# EAGLE schematic gps_and_sensor_CURRENT (EAGLE 8.7.1)
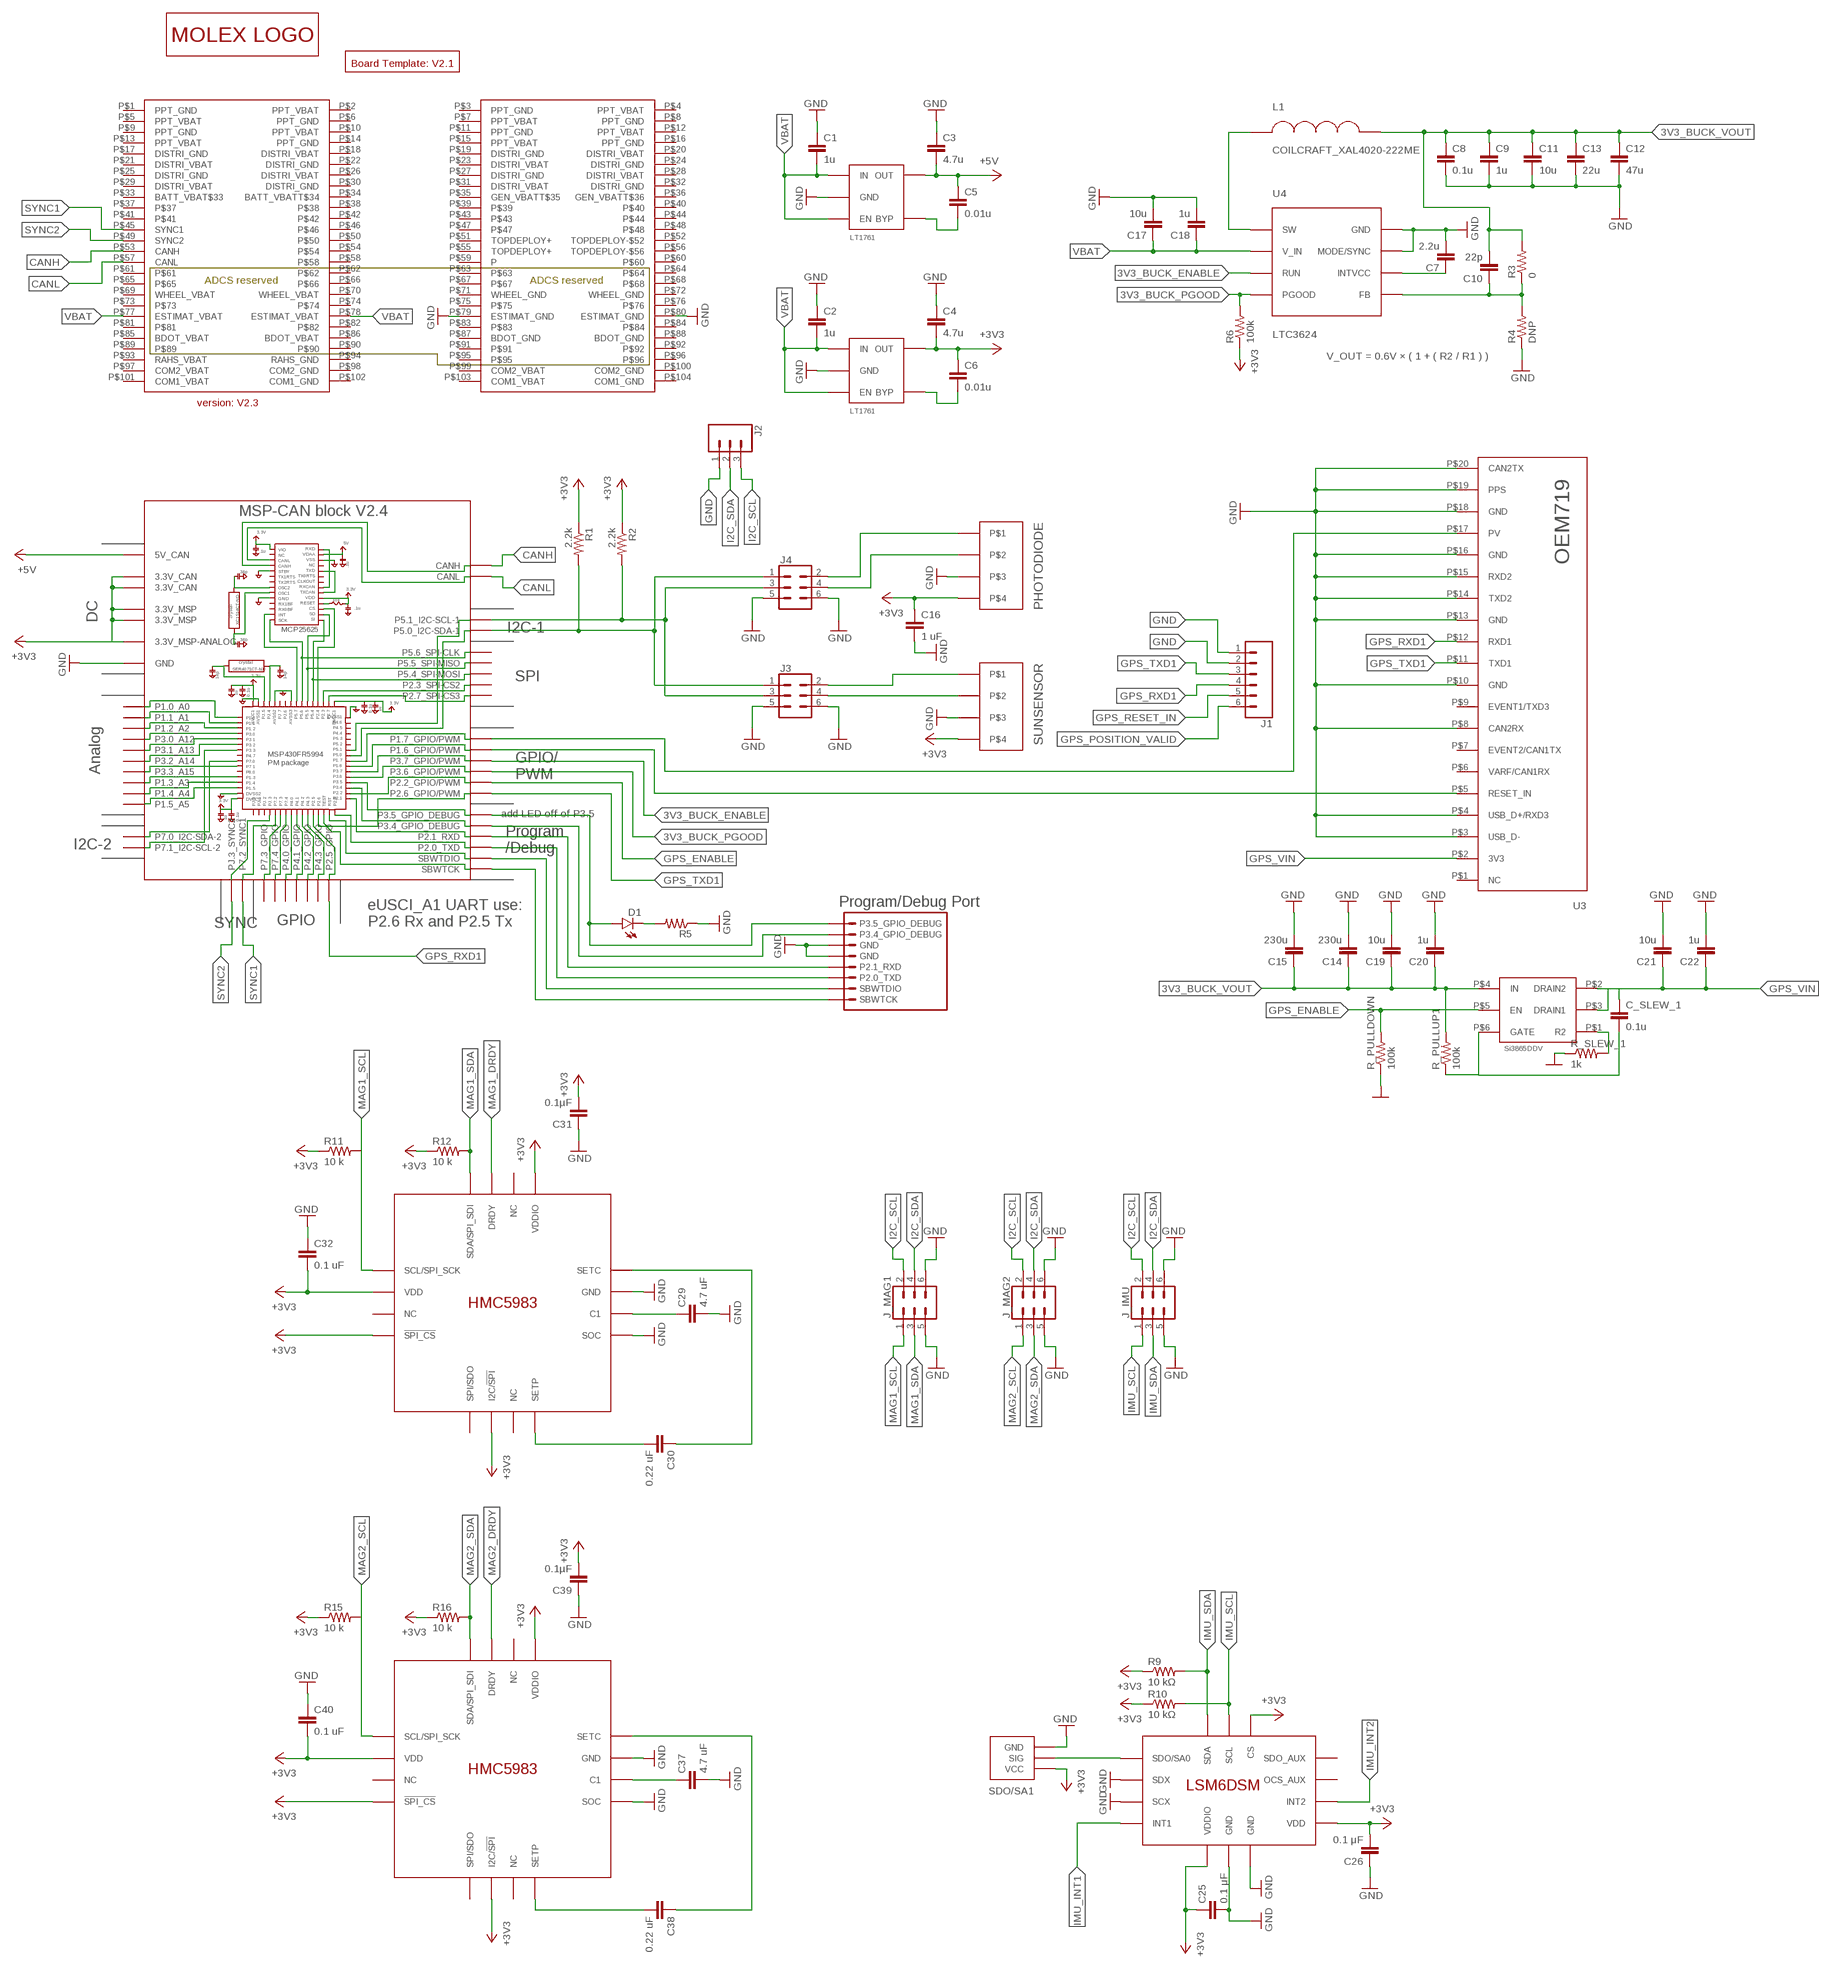
[diagram p0: schematic, sheet 1]

## Parts
B1  BOARD_TEMPLATESERCURED  [BOARD_TEMPLATE_SECURED]
BLK1  MSP-CAN_BLOCK  [MSP-CAN_BLOCK]
C1  1u  CAPACITOR0805  [0805]
C2  1u  CAPACITOR0805  [0805]
C3  4.7u  CAPACITOR0805  [0805]
C4  4.7u  CAPACITOR0805  [0805]
C5  0.01u  CAPACITOR0805  [0805]
C6  0.01u  CAPACITOR0805  [0805]
C7  2.2u  CAPACITOR0805  [0805]
C8  0.1u  CAPACITOR0805  [0805]
C9  1u  CAPACITOR0805  [0805]
C10  22p  CAPACITOR0805  [0805]
C11  10u  CAPACITOR0805  [0805]
C12  47u  CAPACITOR1206  [1206]
C13  22u  CAPACITOR1206  [1206]
C14  230u  CAPACITORPANASONIC_16SVPG270M  [PANASONIC_SVPG]
C15  230u  CAPACITORPANASONIC_16SVPG270M  [PANASONIC_SVPG]
C16  1 uF  CAPACITOR0805  [0805]
C17  10u  CAPACITOR0805  [0805]
C18  1u  CAPACITOR0805  [0805]
C19  10u  CAPACITOR0805  [0805]
C20  1u  CAPACITOR0805  [0805]
C21  10u  CAPACITOR0805  [0805]
C22  1u  CAPACITOR0805  [0805]
C25  0.1 μF  CAPACITOR0805  [0805]
C26  0.1 μF  CAPACITOR0805  [0805]
C29  4.7 uF  CAPACITOR0805  [0805]
C30  0.22 uF  CAPACITOR0805  [0805]
C31  0.1µF  CAPACITOR0805  [0805]
C32  0.1 uF  CAPACITOR0805  [0805]
C37  4.7 uF  CAPACITOR0805  [0805]
C38  0.22 uF  CAPACITOR0805  [0805]
C39  0.1µF  CAPACITOR0805  [0805]
C40  0.1 uF  CAPACITOR0805  [0805]
C_SLEW_1  0.1u  CAPACITOR0805  [0805]
CONN1  PC104_CONNECTOR  [PC104_CONNECTOR]
D1  LED  [LED-1206]
J1  CONN_06LOCK  [1X06_LOCK]
J2  CONN_03LOCK  [1X03_LOCK]
J3  CONN_03X22X3_SILK_MALE_PTH  [2X3]
J4  CONN_03X22X3_SILK_MALE_PTH  [2X3]
J_IMU  CONN_03X22X3_SILK_MALE_PTH  [2X3]
J_MAG1  CONN_03X22X3_SILK_MALE_PTH  [2X3]
J_MAG2  CONN_03X22X3_SILK_MALE_PTH  [2X3]
L1  COILCRAFT_XAL4020-222ME  [COILCRAFT_XAL4020]
PHOTODIODE  PICOLOCK_4  [PICOLOCK_4]
R1  2.2k  RESISTOR0805  [0805]
R2  2.2k  RESISTOR0805  [0805]
R3  0  RESISTOR0805  [0805]
R4  DNP  RESISTOR0805  [0805]
R5  RESISTOR0805  [0805]
R6  100k  RESISTOR0805  [0805]
R9  10 kΩ  RESISTOR0805  [0805]
R10  10 kΩ  RESISTOR0805  [0805]
R11  10 k  RESISTOR0805  [0805]
R12  10 k  RESISTOR0805  [0805]
R15  10 k  RESISTOR0805  [0805]
R16  10 k  RESISTOR0805  [0805]
R_PULLDOWN  100k  RESISTOR0805  [0805]
R_PULLUP1  100k  RESISTOR0805  [0805]
R_SLEW_1  1k  RESISTOR0805  [0805]
SDO/SA1  0_OHM_JUMPER  [0_OHM_JUMPER]
SUNSENSOR  PICOLOCK_4  [PICOLOCK_4]
U1  LT1761-X  [SOT-23-5]
U2  LT1761-X  [SOT-23-5]
U3  OEM719  [OEM719]
U4  LTC3624  [LTC3624]
U$1  LOGO_MOLEX  [LOGO_MOLEX]
U$2  PROGRAM/DEBUG_PORT  [1X08_CONNECTOR]
U$3  SI3865DDV  [TSOP-6]
U$5  LSM6DSM  [LSM6DSM]
U$6  HMC5983  [HMC5983]
U$8  HMC5983  [HMC5983]

## Nets
3V3_BUCK_ENABLE: BLK1.P3.7_GPIO/PWM U4.RUN
3V3_BUCK_FB: C10.1 R3.1 R4.2 U4.FB
3V3_BUCK_INTVCC: C7.1 U4.INTVCC
3V3_BUCK_PGOOD: BLK1.P3.6_GPIO/PWM R6.2 U4.PGOOD
3V3_BUCK_SW: L1.P$1 U4.SW
3V3_BUCK_VOUT: C8.1 C9.1 C10.2 C11.1 C12.1 C13.1 C14.POS C15.POS C19.1 C20.1 L1.P$2 R3.2 R_PULLUP1.2 U$3.P$4(IN)
+3V3: R6.1
CANH: BLK1.CANH CONN1.P$53(CANH)
CANL: BLK1.CANL CONN1.P$57(CANL)
GND: BLK1.GND@1(GND) BLK1.GND@2(GND) BLK1.GND@3(GND) BLK1.GND@4(GND) BLK1.GND@5(GND) BLK1.GND@7(GND) BLK1.GND@8(GND) BLK1.GND@9(GND) BLK1.GND@10(GND) BLK1.GND@11(GND) BLK1.GND@12(GND) BLK1.GND@13(GND) BLK1.GND@14(GND) BLK1.GND@15(GND) BLK1.GND@16(GND) BLK1.GND@17(GND) BLK1.GND@26(GND) C1.1 C2.1 C3.1 C4.1 C7.2 C8.2 C9.2 C11.2 C12.2 C13.2 C14.NEG C15.NEG C16.2 C17.2 C18.2 C19.2 C20.2 C21.2 C22.2 C25.2 C26.1 C29.2 C31.1 C32.1 C37.2 C39.1 C40.1 CONN1.P$79(ESTIMAT_GND) CONN1.P$80(ESTIMAT_GND) J1.1 J1.2 J2.1 J3.5 J3.6 J4.5 J4.6 J_IMU.5 J_IMU.6 J_MAG1.5 J_MAG1.6 J_MAG2.5 J_MAG2.6 PHOTODIODE.P$3 R4.1 R5.1 R_PULLDOWN.1 R_SLEW_1.1 SDO/SA1.P$1(GND) SUNSENSOR.P$3 U1.P$2(GND) U2.P$2(GND) U3.P$3(USB_D-) U3.P$4(USB_D+/RXD3) U3.P$8(CAN2RX) U3.P$10(GND) U3.P$13(GND) U3.P$14(TXD2) U3.P$15(RXD2) U3.P$16(GND) U3.P$18(GND) U3.P$19(PPS) U3.P$20(CAN2TX) U4.GND@1(GND) U4.GND@PAD(GND) U4.MODE/SYNC U$2.5(GND) U$2.6(GND) U$5.GND@1(GND) U$5.GND@2(GND) U$5.SCX U$5.SDX U$6.GND U$6.SOC U$8.GND U$8.SOC ; supply symbol labelled DGND
GPS_ENABLE: BLK1.P2.2_GPIO/PWM R_PULLDOWN.2 U$3.P$5(EN)
GPS_POSITION_VALID: BLK1.P1.7_GPIO/PWM J1.6 U3.P$17(PV)
GPS_RESET_IN: BLK1.P1.6_GPIO/PWM J1.5 U3.P$5(RESET_IN)
GPS_RXD1: BLK1.P2.5_GPIO J1.4 U3.P$12(RXD1)
GPS_TXD1: BLK1.P2.6_GPIO/PWM J1.3 U3.P$11(TXD1)
GPS_VIN: C21.1 C22.1 C_SLEW_1.1 U3.P$2(3V3) U$3.P$2(DRAIN2) U$3.P$3(DRAIN1)
I2C_SCL: BLK1.P5.1_I2C-SCL-1 J2.3 J3.3 J4.3 J_IMU.2 J_MAG1.2 J_MAG2.2 R2.2
I2C_SDA: BLK1.P5.0_I2C-SDA-1 J2.2 J3.1 J4.1 J_IMU.4 J_MAG1.4 J_MAG2.4 R1.2
IMU_INT1: U$5.INT1
IMU_INT2: U$5.INT2
IMU_SCL: J_IMU.1 R10.2 U$5.SCL
IMU_SDA: J_IMU.3 R9.2 U$5.SDA
LDO_3V3: BLK1.3.3V@CAN1(3.3V_CAN) BLK1.3.3V@CAN2(3.3V_CAN) BLK1.3.3V@MSP1(3.3V_MSP) BLK1.3.3V@MSP2(3.3V_MSP) BLK1.3.3V_ANALOG@MSP2(3.3V_MSP-ANALOG) C4.2 C6.1 C16.1 C25.1 C26.2 C31.2 C32.2 C39.2 C40.2 PHOTODIODE.P$4 R1.1 R2.1 R9.1 R10.1 R11.1 R12.1 R15.1 R16.1 SDO/SA1.P$3(VCC) SUNSENSOR.P$4 U2.P$5(OUT) U$5.CS U$5.VDD U$5.VDDIO U$6.!SPI_CS U$6.I2C/!SPI U$6.VDD U$6.VDDIO U$8.!SPI_CS U$8.I2C/!SPI U$8.VDD U$8.VDDIO ; supply symbol labelled +3V3
LDO_3V3_BYP: C6.2 U2.P$4(BYP)
LDO_5V: BLK1.5V(5V_CAN) C3.2 C5.1 U1.P$5(OUT) ; supply symbol labelled +5V
LDO_5V_BYP: C5.2 U1.P$4(BYP)
MA1G_C2: C29.1 U$6.C1
MAG1_DRDY: U$6.DRDY
MAG1_SCL: J_MAG1.1 R11.2 U$6.SCL/SPI_SCK
MAG1_SDA: J_MAG1.3 R12.2 U$6.SDA/SPI_SDI
MAG1_SETC1: C30.1 U$6.SETC
MAG1_SETP1: C30.2 U$6.SETP
MAG2_C1: C37.1 U$8.C1
MAG2_DRDY: U$8.DRDY
MAG2_SCL: J_MAG2.1 R15.2 U$8.SCL/SPI_SCK
MAG2_SDA: J_MAG2.3 R16.2 U$8.SDA/SPI_SDI
MAG2_SETC: C38.1 U$8.SETC
MAG2_SETP: C38.2 U$8.SETP
N$1: BLK1.P3.5_GPIO_DEBUG D1.A U$2.8(P3.5_GPIO_DEBUG)
N$2: R_SLEW_1.2 U$3.P$1(R2)
N$3: BLK1.P3.4_GPIO_DEBUG U$2.7(P3.4_GPIO_DEBUG)
N$4: C_SLEW_1.2 R_PULLUP1.1 U$3.P$6(GATE)
N$5: BLK1.P2.1_RXD U$2.4(P2.1_RXD)
N$6: BLK1.P2.0_TXD U$2.3(P2.0_TXD)
N$7: BLK1.SBWTDIO U$2.2(SBWTDIO)
N$8: BLK1.SBWTCK U$2.SBWTCK
N$9: D1.C R5.2
N$11: SDO/SA1.P$2(SIG) U$5.SDO/SA0
PHOTODIODE_SCL: J4.4 PHOTODIODE.P$2
PHOTODIODE_SDA: J4.2 PHOTODIODE.P$1
SUNSENSOR_SCL: J3.4 SUNSENSOR.P$2
SUNSENSOR_SDA: J3.2 SUNSENSOR.P$1
SYNC1: BLK1.P7.2_SYNC1 CONN1.P$45(SYNC1)
SYNC2: BLK1.PJ.3_SYNC2 CONN1.P$49(SYNC2)
VBAT: C1.2 C2.2 C17.1 C18.1 CONN1.P$77(ESTIMAT_VBAT) CONN1.P$78(ESTIMAT_VBAT) U1.P$1(IN) U1.P$3(EN) U2.P$1(IN) U2.P$3(EN) U4.V_IN
Unconnected: BLK1.P1.0_A0 BLK1.P1.1_A1 BLK1.P1.2_A2 BLK1.P1.3_A3 BLK1.P1.4_A4 BLK1.P1.5_A5 BLK1.P2.4_SPI-CS2(P2.3_SPI-CS2) BLK1.P2.7_SPI-CS3 BLK1.P3.0_A12 BLK1.P3.1_A13 BLK1.P3.2_A14 BLK1.P3.3_A15 BLK1.P4.0_GPIO BLK1.P4.1_GPIO BLK1.P4.2_GPIO BLK1.P4.3_GPIO BLK1.P5.4_SPI-MOSI BLK1.P5.5_SPI-MISO BLK1.P5.6_SPI-CLK BLK1.P7.0_I2C-SDA-2 BLK1.P7.1_I2C-SCL-2 BLK1.P7.3_GPIO BLK1.P7.4_GPIO CONN1.P$1(PPT_GND) CONN1.P$2(PPT_VBAT) CONN1.P$3(PPT_GND) CONN1.P$4(PPT_VBAT) CONN1.P$5(PPT_VBAT) CONN1.P$6(PPT_GND) CONN1.P$7(PPT_VBAT) CONN1.P$8(PPT_GND) CONN1.P$9(PPT_GND) CONN1.P$10(PPT_VBAT) CONN1.P$11(PPT_GND) CONN1.P$12(PPT_VBAT) CONN1.P$13(PPT_VBAT) CONN1.P$14(PPT_GND) CONN1.P$15(PPT_VBAT) CONN1.P$16(PPT_GND) CONN1.P$17(DISTRI_GND) CONN1.P$18(DISTRI_VBAT) CONN1.P$19(DISTRI_GND) CONN1.P$20(DISTRI_VBAT) CONN1.P$21(DISTRI_VBAT) CONN1.P$22(DISTRI_GND) CONN1.P$23(DISTRI_VBAT) CONN1.P$24(DISTRI_GND) CONN1.P$25(DISTRI_GND) CONN1.P$26(DISTRI_VBAT) CONN1.P$27(DISTRI_GND) CONN1.P$28(DISTRI_VBAT) CONN1.P$29(DISTRI_VBAT) CONN1.P$30(DISTRI_GND) CONN1.P$31(DISTRI_VBAT) CONN1.P$32(DISTRI_GND) CONN1.P$33(BATT_VBAT$33) CONN1.P$34(BATT_VBATT$34) CONN1.P$35(GEN_VBATT$35) CONN1.P$36(GEN_VBATT$36) CONN1.P$37 CONN1.P$38 CONN1.P$39 CONN1.P$40 CONN1.P$41 CONN1.P$42 CONN1.P$43 CONN1.P$44 CONN1.P$46 CONN1.P$47 CONN1.P$48 CONN1.P$50 CONN1.P$51(TOPDEPLOY+) CONN1.P$52(TOPDEPLOY-$52) CONN1.P$54 CONN1.P$55(TOPDEPLOY+) CONN1.P$56(TOPDEPLOY-$56) CONN1.P$58 CONN1.P$59(P) CONN1.P$60 CONN1.P$61 CONN1.P$62 CONN1.P$63 CONN1.P$64 CONN1.P$65 CONN1.P$66 CONN1.P$67 CONN1.P$68 CONN1.P$69(WHEEL_VBAT) CONN1.P$70(WHEEL_VBAT) CONN1.P$71(WHEEL_GND) CONN1.P$72(WHEEL_GND) CONN1.P$73 CONN1.P$74 CONN1.P$75 CONN1.P$76 CONN1.P$81 CONN1.P$82 CONN1.P$83 CONN1.P$84 CONN1.P$85(BDOT_VBAT) CONN1.P$86(BDOT_VBAT) CONN1.P$87(BDOT_GND) CONN1.P$88(BDOT_GND) CONN1.P$89 CONN1.P$90 CONN1.P$91 CONN1.P$92 CONN1.P$93(RAHS_VBAT) CONN1.P$94(RAHS_GND) CONN1.P$95 CONN1.P$96 CONN1.P$97(COM2_VBAT) CONN1.P$98(COM2_GND) CONN1.P$99(COM2_VBAT) CONN1.P$100(COM2_GND) CONN1.P$101(COM1_VBAT) CONN1.P$102(COM1_GND) CONN1.P$103(COM1_VBAT) CONN1.P$104(COM1_GND) U3.P$1(NC) U3.P$6(VARF/CAN1RX) U3.P$7(EVENT2/CAN1TX) U3.P$9(EVENT1/TXD3) U$5.OCS_AUX U$5.SDO_AUX U$6.NC@1(NC) U$6.NC@2(NC) U$6.NC@3(NC) U$6.SPI_SDO(SPI/SDO) U$8.NC@1(NC) U$8.NC@2(NC) U$8.NC@3(NC) U$8.SPI_SDO(SPI/SDO)

## Notes on the sheet
- V_OUT = 0.6V × ( 1 + ( R2 / R1 ) )

## Library data of the parts
B1 = DubSat1 Components:BOARD_TEMPLATE
BLK1 = DubSat1 Components:MSP-CAN_BLOCK
C1-C22 C25 C26 C29-C32 C37-C40 C_SLEW_1 = DubSat1 Components:CAPACITOR: Capacitor Standard 0603 ceramic capacitor, and 0.1" leaded capacitor.
CONN1 = DubSat1 Components:PC104_CONNECTOR
D1 = DubSat1 Components:LED
J1 = SparkFun-Connectors:CONN_06: Multi connection point. Often used as Generic Header-pin footprint for 0.1 inch spaced/style header connections On any of the 0.1 inch spaced packages, you can populate with these: Break Away Headers - Straight <https://www.sparkfun.com/products/116> (PRT-00116) Break Away Male Headers - Right Angle <https://www.sparkfun.com/products/553> (PRT-00553) Female Headers <https://www.sparkfun.com/products/115> (PRT-00115) Break Away Headers - Machine Pin <https://www.sparkfun.com/products/117> (PRT-00117) Break Away Female Headers - Swiss Machine Pin <https://www.sparkfun.com/products/743> (PRT-00743) Arduino Stackable Header - 6 Pin <https://www.sparkfun.com/products/9280> (PRT-09280) For SCREWTERMINALS and SPRING TERMINALS visit here: Screw Terimnals on SparkFun.com <https://www.sparkfun.com/search/results?term=Screw+Terminals> (5mm/3.5mm/2.54mm spacing) This device is also useful as a general connection point to wire up your design to another part of your project. Our various solder wires solder well into these plated through hole pads. Hook-Up Wire - Assortment (Stranded, 22 AWG) <https://www.sparkfun.com/products/11375> (PRT-11375) Hook-Up Wire - Assortment (Solid Core, 22 AWG) <https://www.sparkfun.com/products/11367> (PRT-11367) View the entire wire category on our website here <https://www.sparkfun.com/categories/141>
J2 = SparkFun-Connectors:CONN_03: Multi connection point. Often used as Generic Header-pin footprint for 0.1 inch spaced/style header connections On any of the 0.1 inch spaced packages, you can populate with these: Break Away Headers - Straight <https://www.sparkfun.com/products/116> (PRT-00116) Break Away Male Headers - Right Angle <https://www.sparkfun.com/products/553> (PRT-00553) Female Headers <https://www.sparkfun.com/products/115> (PRT-00115) Break Away Headers - Machine Pin <https://www.sparkfun.com/products/117> (PRT-00117) Break Away Female Headers - Swiss Machine Pin <https://www.sparkfun.com/products/743> (PRT-00743) Stackable Header - 3 Pin (Female, 0.1") <https://www.sparkfun.com/products/13875> (PRT-13875) For SCREWTERMINALS and SPRING TERMINALS visit here: Screw Terimnals on SparkFun.com <https://www.sparkfun.com/search/results?term=Screw+Terminals> (5mm/3.5mm/2.54mm spacing) This device is also useful as a general connection point to wire up your design to another part of your project. Our various solder wires solder well into these plated through hole pads. Hook-Up Wire - Assortment (Stranded, 22 AWG) <https://www.sparkfun.com/products/11375> (PRT-11375) Hook-Up Wire - Assortment (Solid Core, 22 AWG) <https://www.sparkfun.com/products/11367> (PRT-11367) View the entire wire category on our website here <https://www.sparkfun.com/categories/141> Special notes: Molex polarized connector foot print use with SKU : PRT-08232 with associated crimp pins and housings.
J3 J4 J_IMU J_MAG1 J_MAG2 = SparkFun-Connectors:CONN_03X2: Multi connection point. Often used as Generic Header-pin footprint for 0.1 inch spaced/style header connections You can populate with any combo of single row headers, but if you'd like an exact match, check these: Header - 2x3 (Male, 0.1") <https://www.sparkfun.com/products/12807> (PRT-12807) Header - 2x3 (Female, 0.1") <https://www.sparkfun.com/products/13010> (PRT-13010) 2x3 Pin Shrouded Header <https://www.sparkfun.com/products/10877> (PRT-10877) On any of the 0.1 inch spaced packages, you can populate with these: Break Away Headers - Straight <https://www.sparkfun.com/products/116> (PRT-00116) Break Away Male Headers - Right Angle <https://www.sparkfun.com/products/553> (PRT-00553) Female Headers <https://www.sparkfun.com/products/115> (PRT-00115) Break Away Headers - Machine Pin <https://www.sparkfun.com/products/117> (PRT-00117) Break Away Female Headers - Swiss Machine Pin <https://www.sparkfun.com/products/743> (PRT-00743) Special note: the shrouded connector mates well with our 3x2 ribbon cables: Ribbon Crimp Connector - 6-pin (2x3, Female) <https://www.sparkfun.com/products/10651> (PRT-10651) Ribbon Cable - 6 wire (15ft) <https://www.sparkfun.com/products/10646> (PRT-10646); PROD_ID: CONN-09701
L1 = DubSat1 Components:COILCRAFT_XAL4020-222ME
PHOTODIODE SUNSENSOR = DubSat1 Components:PICOLOCK_4
R1-R6 R9-R12 R15 R16 R_PULLDOWN R_PULLUP1 R_SLEW_1 = DubSat1 Components:RESISTOR: Resistor Basic schematic elements and footprints for 0603, 1206, and PTH resistors.
SDO/SA1 = DubSat1 Components:0_OHM_JUMPER
U1 U2 = DubSat1 Components:LT1761-X
U3 = DubSat1 Components:OEM719
U4 = DubSat1 Components:LTC3624
U$1 = HuskySat-1 Logos:LOGO_MOLEX
U$2 = DubSat1 Components:PROGRAM/DEBUG_PORT
U$3 = DubSat1 Components:SI3865DDV
U$5 = LSM6DSM:LSM6DSM
U$6 U$8 = DubSat1 Components:HMC5983